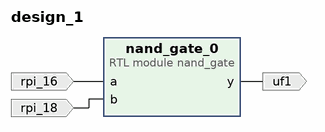
[diagram p0: block diagram of the top level]
# Vivado block design design_1, xck26-sfvc784-2LV-c, Vivado 2024.1
create_bd_design design_1

create_bd_port -dir I rpi_16
create_bd_port -dir I rpi_18
create_bd_port -dir O uf1

create_bd_cell -type module -reference nand_gate nand_gate_0

# ---- connections ----

connect_bd_net -net a_0_1 [get_bd_ports rpi_16] [get_bd_pins nand_gate_0/a]
connect_bd_net -net b_0_1 [get_bd_ports rpi_18] [get_bd_pins nand_gate_0/b]
connect_bd_net [get_bd_pins nand_gate_0/y] [get_bd_ports uf1]

validate_bd_design
save_bd_design
